# Altium project ToF.PrjPcb
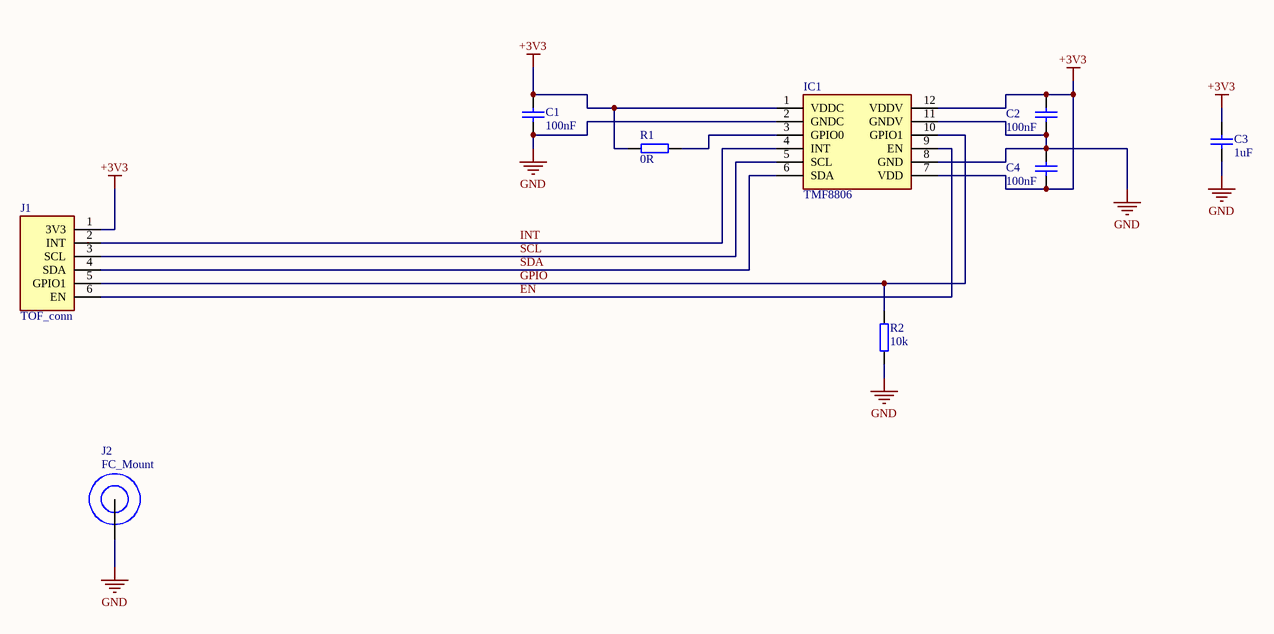
[diagram p0: ToF.SchDoc]
1 sheet, 9 parts. Net scope: global (net labels, ports and power ports of the same name join across sheets).
Board file: PCB.PcbDoc

## Sheet ToF.SchDoc
size A3; SheetNumber: 1; SheetTotal: 1

### Parts
C1  value 100nF  [CAP0402]  (hidden comment: Cap0402)
C2  value 100nF  [CAP0402]  (hidden comment: Cap0402)
C3  value 1uF  [CAP0603]  (hidden comment: Cap0603)
C4  value 100nF  [CAP0402]  (hidden comment: Cap0402)
IC1  TMF8806  [TMF88051B]
J1  TOF_conn  [PCBComponent_1]
J2  FC_Mount  [FC_Mount]
R1  value 0R  [RES0402]  (hidden comment: Res0402)
R2  value 10k  [RES0402]  (hidden comment: Res0402)

### Nets
+3V3: C1.2 C2.2 C3.2 C4.1 IC1.1(VDDC) IC1.7(VDD) IC1.12(VDDV) J1.1(3V3) R1.1
GND: C1.1 C2.1 C3.1 C4.2 IC1.2(GNDC) IC1.8(GND) IC1.11(GNDV) J2.1 R2.1
EN: IC1.9(EN) J1.6(EN)
GPIO: IC1.10(GPIO1) J1.5(GPIO1) R2.2
INT: IC1.4(INT) J1.2(INT)
SCL: IC1.5(SCL) J1.3(SCL)
SDA: IC1.6(SDA) J1.4(SDA)
NetIC1_3: IC1.3(GPIO0) R1.2

### Library data of the parts
C1 C2 C4 = Cap0402: Voltage: 6V3
C3 = Cap0603: Voltage: 25V
IC1 = TMF8805-1B: Integrated Circuit; Manufacturer_Name: ams OSRAM; Datasheet Link: https://ams.com/documents/20143/4372629/TMF8805_DS000692_4-00.pdf; Height: 1.1mm; Manufacturer_Part_Number: TMF8805-1B; Mouser Part Number: 985-TMF8805-1B; Mouser Price/Stock: https://www.mouser.co.uk/ProductDetail/ams-OSRAM/TMF8805-1B?qs=sPbYRqrBIVlwsjHE%2F%252BrL9g%3D%3D